# Altium schematic sheet RF.SchDoc
size 594 x 420 mm
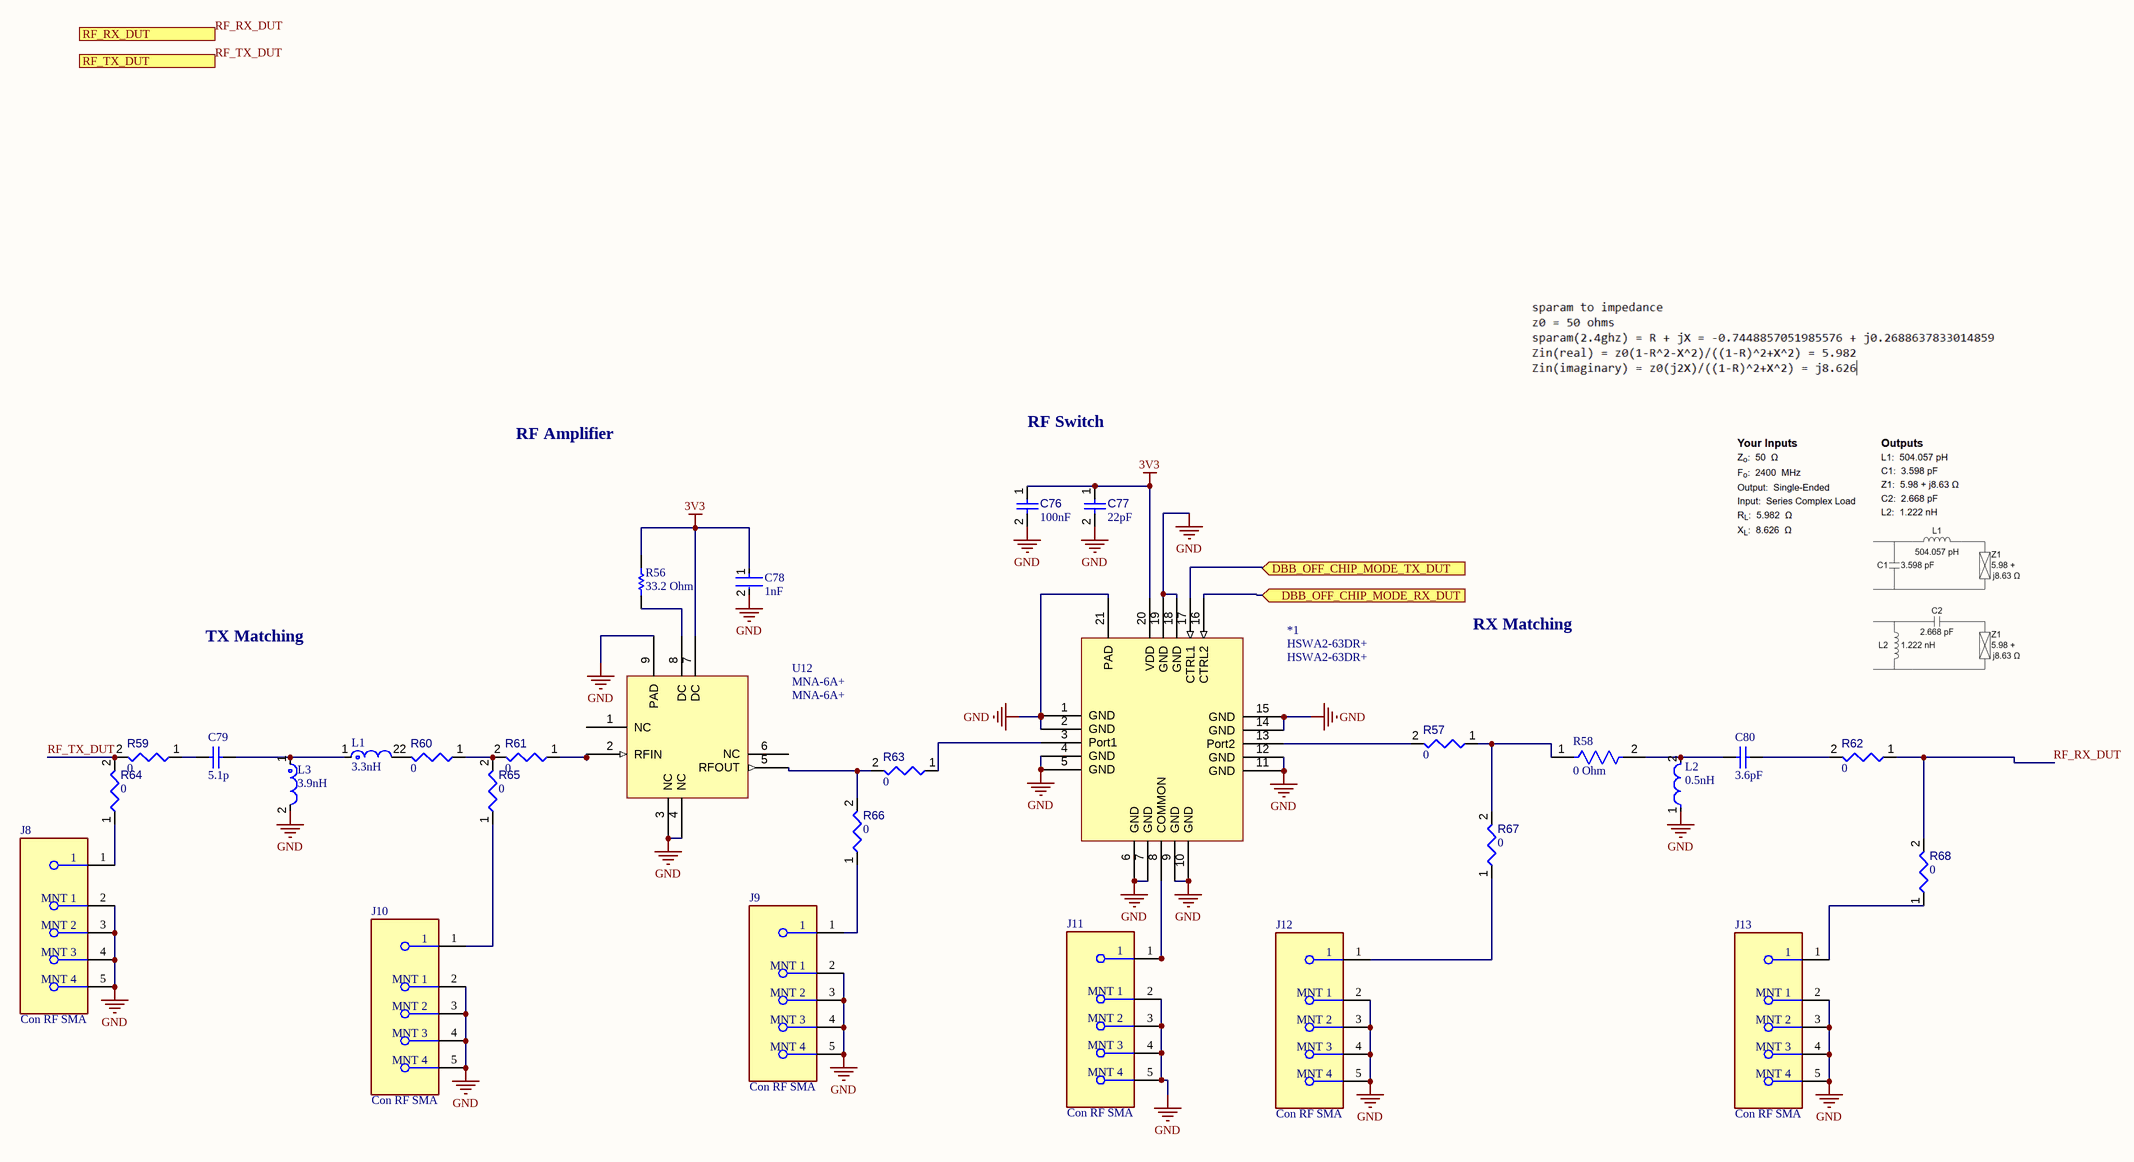
[diagram p0: RF.SchDoc]

## Parts
*1  HSWA2-63DR+  [HSWA2-63DR+-Footprint-1]
C76  value 100nF  [CAPC1005X56X25LL10T15]  (hidden comment: 0.1uF)
C77  22pF  [CAPC0402(1005)60_L]
C78  1nF  [FP-CL10-IPC_C]
C79  5.1p  [CAPC1608X90X35NL15T15]
C80  3.6pF  [CAPC1608X74X38LL10T13]
J8  Con RF SMA  [FP-RF2-04A-T-00-50-G-MFG]
J9  Con RF SMA  [FP-RF2-04A-T-00-50-G-MFG]
J10  Con RF SMA  [FP-RF2-04A-T-00-50-G-MFG]
J11  Con RF SMA  [FP-RF2-04A-T-00-50-G-MFG]
J12  Con RF SMA  [FP-RF2-04A-T-00-50-G-MFG]
J13  Con RF SMA  [FP-RF2-04A-T-00-50-G-MFG]
L1  3.3nH  [FP-LQG18HH_00-MFG]
L2  0.5nH  [FP-LQW18AN_00-MFG]
L3  3.9nH  [FP-LQG18HH_00-MFG]
R56  33.2 Ohm  [RESC1608X55X25NL10T15]
R57  value 0  [RESC0603(1608)_L]  (hidden comment: 0R3J)
R58  0 Ohm  [FP-CRCW0603-C-IPC_B]
R59  value 0  [RESC0603(1608)_L]  (hidden comment: 0R3J)
R60  value 0  [RESC0603(1608)_L]  (hidden comment: 0R3J)
R61  value 0  [RESC0603(1608)_L]  (hidden comment: 0R3J)
R62  value 0  [RESC0603(1608)_L]  (hidden comment: 0R3J)
R63  value 0  [RESC0603(1608)_L]  (hidden comment: 0R3J)
R64  value 0  [RESC0603(1608)_L]  (hidden comment: 0R3J)
R65  value 0  [RESC0603(1608)_L]  (hidden comment: 0R3J)
R66  value 0  [RESC0603(1608)_L]  (hidden comment: 0R3J)
R67  value 0  [RESC0603(1608)_L]  (hidden comment: 0R3J)
R68  value 0  [RESC0603(1608)_L]  (hidden comment: 0R3J)
U12  MNA-6A+  [MNA-6A+-Footprint-1]

## Ports
DBB_OFF_CHIP_MODE_RX_DUT (in), DBB_OFF_CHIP_MODE_TX_DUT (in), RF_RX_DUT (out), RF_TX_DUT (in)

## Nets
3V3: *1.20(VDD) C76.1 C77.1 C78.1 R56.2 U12.7(DC)
GND: *1.1(GND) *1.2(GND) *1.4(GND) *1.5(GND) *1.6(GND) *1.7(GND) *1.9(GND) *1.10(GND) *1.11(GND) *1.12(GND) *1.14(GND) *1.15(GND) *1.18(GND) *1.19(GND) *1.21(PAD) C76.2 C77.2 C78.2 J8.2(MNT_1) J8.3(MNT_2) J8.4(MNT_3) J8.5(MNT_4) J9.2(MNT_1) J9.3(MNT_2) J9.4(MNT_3) J9.5(MNT_4) J10.2(MNT_1) J10.3(MNT_2) J10.4(MNT_3) J10.5(MNT_4) J11.2(MNT_1) J11.3(MNT_2) J11.4(MNT_3) J11.5(MNT_4) J12.2(MNT_1) J12.3(MNT_2) J12.4(MNT_3) J12.5(MNT_4) J13.2(MNT_1) J13.3(MNT_2) J13.4(MNT_3) J13.5(MNT_4) L2.1 L3.2 U12.3(NC) U12.4(NC) U12.9(PAD)
DBB_OFF_CHIP_MODE_RX_DUT: *1.16(CTRL2) ; port DBB_OFF_CHIP_MODE_RX_DUT
DBB_OFF_CHIP_MODE_TX_DUT: *1.17(CTRL1) ; port DBB_OFF_CHIP_MODE_TX_DUT
RF_RX_DUT: R62.1 R68.2 ; port RF_RX_DUT
RF_TX_DUT: R59.2 R64.2 ; port RF_TX_DUT
Net*1_3: *1.3(Port1) R63.1
Net*1_8: *1.8(COMMON) J11.1
Net*1_13: *1.13(Port2) R57.2
NetC79_1: C79.1 R59.1
NetC79_2: C79.2 L1.1 L3.1
NetC80_1: C80.1 L2.2 R58.2
NetC80_2: C80.2 R62.2
NetJ8_1: J8.1 R64.1
NetJ9_1: J9.1 R66.1
NetJ10_1: J10.1 R65.1
NetJ12_1: J12.1 R67.1
NetJ13_1: J13.1 R68.1
NetL1_2: L1.2 R60.2
NetR56_1: R56.1 U12.8(DC)
NetR57_1: R57.1 R58.1 R67.2
NetR60_1: R60.1 R61.2 R65.2
NetR61_1: R61.1 U12.2(RFIN)
NetR63_2: R63.2 R66.2 U12.5(RFOUT)

Not connected (* = marked no-connect by the designer): U12 1(NC) 6(NC)

## Notes on the sheet
- RF Amplifier
- RF Switch
- TX Matching
- RX Matching

## Library data of the parts
*1 = CMP-005-000000-2: Absorptive SPDT, SMT Solid State; Manufacturer: Mini-Circuits; U10: HSWA2-63DR+; RoHS Compliant: Yes; Manufacturer Part Number: HSWA2-63DR+; RoHS: Yes; Source: Schlib1.SchLib; Stock 1: 1789; Pricing 1: 1=5.16000, 10=4.61000, 50=4.15000, 100=3.72000, 1000=2.18000, 10000=2.18000 (USD); Design Item ID: HSWA2-63DR+
C76 = CMP-001-00001-6: Chip Capacitor, 0.1 uF, +/- 5%, 16 V, 0402 (1005 Metric); Capacitor Type: Ceramic; Voltage Rating: 16V; Max Operating Temperature: 125°C; Min Operating Temperature: -55°C; Case/Package: 0402; Mounting Technology: SM; Pins: 2; Tolerance: 5%; RoHS Compliant: True
C77 = CMP-001-00073-3: Chip Capacitor, 22pF +/-10%, 50V, 0402, Thickness 0.6 mm; Tolerance: 10%; Pins: 2; Voltage Rating: 50V; Max Operating Temperature: 85°C; Min Operating Temperature: -55°C; Mounting Technology: SMT; Case/Package: 0402; Value: 22pF
C78 = CMP-2000-06091-2: Cap Ceramic 1nF 50V X7R ±10% Pad SMD 0603 +125°C T/R; Radiation Hardening: No; Length: 1.6mm; Capacitance: 1nF; Voltage Rating: 50V; Case Code (Imperial): 0603; Case Code (Metric): 1608; Max Operating Temperature: 125°C; Thickness: 0.035inch; Voltage Rating (DC): 50V; Contact Plating: Tin; Width: 0.031inch; Mount: Surface Mount; Lead Free: Lead Free; Voltage: 50V; Material: Ceramic; Package Quantity: 1; Dielectric: X7R; Case/Package: 0603; Height: 0.8mm; Min Operating Temperature: -55°C; Tolerance: 10%; Depth: 0.8mm; Packaging: Tape and Reel
C79 = CMP-2006-04578-1: Part Number: 06031A5R1CAT2A; Manufacturer: AVX Interconnect / Elco
C80 = CMP-2006-03975-1: Manufacturer: AVX Interconnect / Elco; Part Number: ML03V13R6BAT2A
J8-J13 = CMP-42753-000002-1: CONN SMA JACK STR 50 OHM PCB
L1 = CMP-06042-009861-1: Multilayer type RF Inductor 3.3nH ±0.3nH 0.12Ω 1000mA 0603; Max DC Current: 500mA; Q Factor: 12; DC Resistance (DCR): 150mR; Test Frequency: 100MHz; Self Resonant Frequency: 6GHz; Shielding: Unshielded; Core Material: Air; Case/Package: 0603; DC Current: 500mA; Case Code (Metric): 1608; Package Quantity: 4000; Depth: 0.95mm; Max Operating Temperature: 85°C; Height - Seated (Max): 0.037inch; Mount: Surface Mount; REACH SVHC: No SVHC; Length: 1.6mm; Min Operating Temperature: -55°C; Military Standard: Not; Lead Free: Lead Free; Width: 0.8mm; Packaging: Tape and Reel; Height: 0.8mm; Termination: SMD/SMT; Current Rating: 500mA; Case Code (Imperial): 0603; Inductance: 3.3nH; Radiation Hardening: No
L2 = CMP-06042-003914-1: Wire Wound RF Inductor 5.6nH ±0.5nH 750mA 0.082Ω 0603 (1608); Test Frequency: 100MHz; Self Resonant Frequency: 6GHz; Q Factor: 35; Core Material: Non-Magnetic; DC Resistance (DCR): 82mR; Shielding: Unshielded; Number of Pins: 2; Case Code (Imperial): 0603; Height: 0.8mm; Packaging: Tape and Reel; Case/Package: 0603; Lead Free: Lead Free; Height - Seated (Max): 0.039inch; Width: 0.8mm; Military Standard: Not; Weight: 0.000106oz; Length: 1.6mm; Case Code (Metric): 1608; Radiation Hardening: No; DC Current: 750mA; Resistor Type: Wirewound; Min Operating Temperature: -55°C; Max DC Current: 750mA; Package Quantity: 4000; Current Rating: 750mA; Termination: SMD/SMT; Depth: 1mm; Max Operating Temperature: 125°C; REACH SVHC: No SVHC; Mount: Surface Mount; Inductance: 5.6nH
L3 = CMP-06042-010111-1: Multilayer type RF Inductor 3.9nH ±0.3nH 0.15Ω 900mA 0603; Core Material: Air; Max DC Current: 450mA; Q Factor: 12; DC Resistance (DCR): 150mR; Shielding: Unshielded; Self Resonant Frequency: 6GHz; Test Frequency: 100MHz; Packaging: Tape and Reel; Radiation Hardening: No; Package Quantity: 4000; Height - Seated (Max): 0.037inch; Case Code (Metric): 1608; Military Standard: Not; Depth: 0.95mm; DC Current: 450mA; Height: 0.8mm; Length: 1.6mm; Lead Free: Lead Free; Min Operating Temperature: -55°C; Mount: Surface Mount; REACH SVHC: No SVHC; Case Code (Imperial): 0603; Max Operating Temperature: 85°C; Case/Package: 0603; Width: 0.8mm; Termination: SMD/SMT; Inductance: 3.9nH; Current Rating: 450mA
R56 = CMP-2000-04014-1: Manufacturer: Yageo; Part Number: RC0603FR-0733R2L
R57 R59-R68 = CMP-009-00063-2: Jumper 0603 (1608 Metric); Case/Package: 0603; Mounting Technology: SMT; Pins: 2
R58 = CMP-02407-012292-2: RES 0 OHM JUMPER 1/10W 0603; Resistance: 22R; Power Rating: 100mW; Case/Package: Molded; Contact Plating: Tin; Resistor Type: Thick Film; Min Operating Temperature: -55°C; Termination: Wraparound; Max Operating Temperature: 155°C; Lead Free: Lead Free; Length: 1.55mm; RoHS Compliant: Yes; Mount: Surface Mount
U12 = CMP-003-000000-2: RF Amp Single MMIC Amp 2.5GHz 5V 8-Pin Case DQ-849 T/R; Manufacturer: Mini-Circuits; U11: MNA-6A+; Pricing 1: 1=5.10000, 10=4.55800, 50=4.10220, 100=3.73760, 500=3.02652, 1000=2.55248 (USD); RoHS: Yes; Stock 1: 29769; Category: RF Amplifiers; Source: Schlib1.SchLib; Design Item ID: MNA-6A+; RoHS Compliant: Yes; Manufacturer Part Number: MNA-6A+